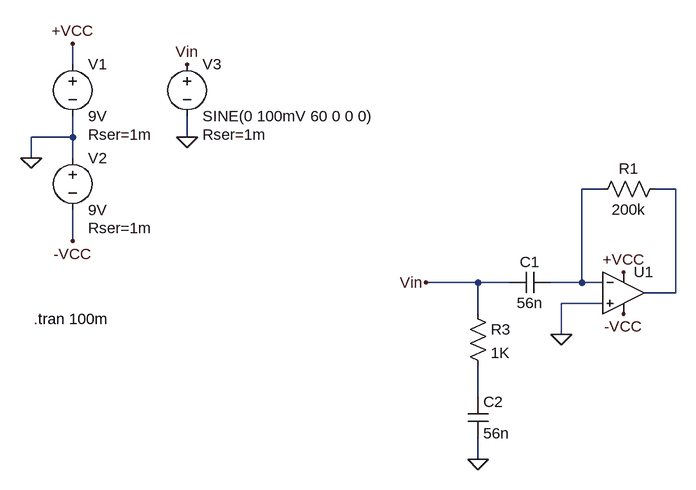
[diagram p0: schematic pedal.asc]
pedal.asc, the LTspice schematic file:
Version 4
SHEET 1 880 680
WIRE -512 -96 -512 -128
WIRE -512 16 -512 -16
WIRE -512 16 -576 16
WIRE -336 16 -336 -16
WIRE -576 48 -576 16
WIRE -512 48 -512 16
WIRE 304 96 272 96
WIRE 416 96 384 96
WIRE -512 176 -512 128
WIRE 112 240 32 240
WIRE 160 240 112 240
WIRE 272 240 272 96
WIRE 272 240 224 240
WIRE 304 240 272 240
WIRE 416 256 416 96
WIRE 416 256 368 256
WIRE 304 272 240 272
WIRE 112 288 112 240
WIRE 240 320 240 272
WIRE 112 416 112 368
WIRE 112 512 112 480
FLAG -512 -128 +VCC
FLAG -512 176 -VCC
FLAG -576 48 0
FLAG 336 288 -VCC
FLAG 336 224 +VCC
FLAG 240 320 0
FLAG 32 240 Vin
FLAG -336 16 0
FLAG -336 -96 Vin
FLAG 112 512 0
SYMBOL Opamps\\UniversalOpamp2 336 256 R0
SYMATTR InstName U1
SYMBOL voltage -512 -112 R0
WINDOW 123 0 0 Left 2
WINDOW 39 24 124 Left 2
SYMATTR InstName V1
SYMATTR Value 9V
SYMATTR SpiceLine Rser=1m
SYMBOL voltage -512 32 R0
WINDOW 123 0 0 Left 2
WINDOW 39 24 124 Left 2
SYMATTR InstName V2
SYMATTR Value 9V
SYMATTR SpiceLine Rser=1m
SYMBOL res 288 112 R270
WINDOW 0 32 56 VTop 2
WINDOW 3 0 56 VBottom 2
SYMATTR InstName R1
SYMATTR Value 200k
SYMATTR SpiceLine tol=1 pwr=0.1
SYMBOL voltage -336 -112 R0
WINDOW 123 0 0 Left 2
WINDOW 39 24 124 Left 2
SYMATTR InstName V3
SYMATTR Value SINE(0 100mV 60 0 0 0)
SYMATTR SpiceLine Rser=1m
SYMBOL res 96 272 R0
SYMATTR InstName R3
SYMATTR Value 1K
SYMATTR SpiceLine tol=1 pwr=0.1
SYMBOL cap 224 224 R90
WINDOW 0 0 32 VBottom 2
WINDOW 3 32 32 VTop 2
SYMATTR InstName C1
SYMATTR Value 56n
SYMATTR SpiceLine V=25 Irms=0 Rser=0.001 Lser=0 mfg="TDK" pn="C575OX7RIE106M" type="X7R"
SYMBOL cap 96 416 R0
SYMATTR InstName C2
SYMATTR Value 56n
SYMATTR SpiceLine V=25 Irms=0 Rser=0.001 Lser=0 mfg="TDK" pn="C575OX7RIE106M" type="X7R"
TEXT -572 296 Left 2 !.tran 100m

The netlist it stands for:
* pedal.asc
XU1 0 N001 +VCC -VCC N002 level.2 Avol=1Meg GBW=10Meg Slew=10Meg ilimit=25m rail=0 Vos=0 phimargin=45 en=0 enk=0 in=0 ink=0 Rin=500Meg  ; pins IN+ IN- V+ V- OUT
V1 +VCC 0 9V Rser=1m
V2 0 -VCC 9V Rser=1m
R1 N001 N002 200k tol=1 pwr=0.1
V3 Vin 0 SINE(0 100mV 60 0 0 0) Rser=1m
R3 Vin N003 1K tol=1 pwr=0.1
C1 N001 Vin 56n V=25 Irms=0 Rser=0.001 Lser=0 mfg="TDK" pn="C575OX7RIE106M" type="X7R"
C2 N003 0 56n V=25 Irms=0 Rser=0.001 Lser=0 mfg="TDK" pn="C575OX7RIE106M" type="X7R"
.tran 100m
.lib UniversalOpamps2.sub
.backanno
.end